# Altium schematic sheet 11 AM572x Interface 2.SchDoc
size 420 x 297 mm
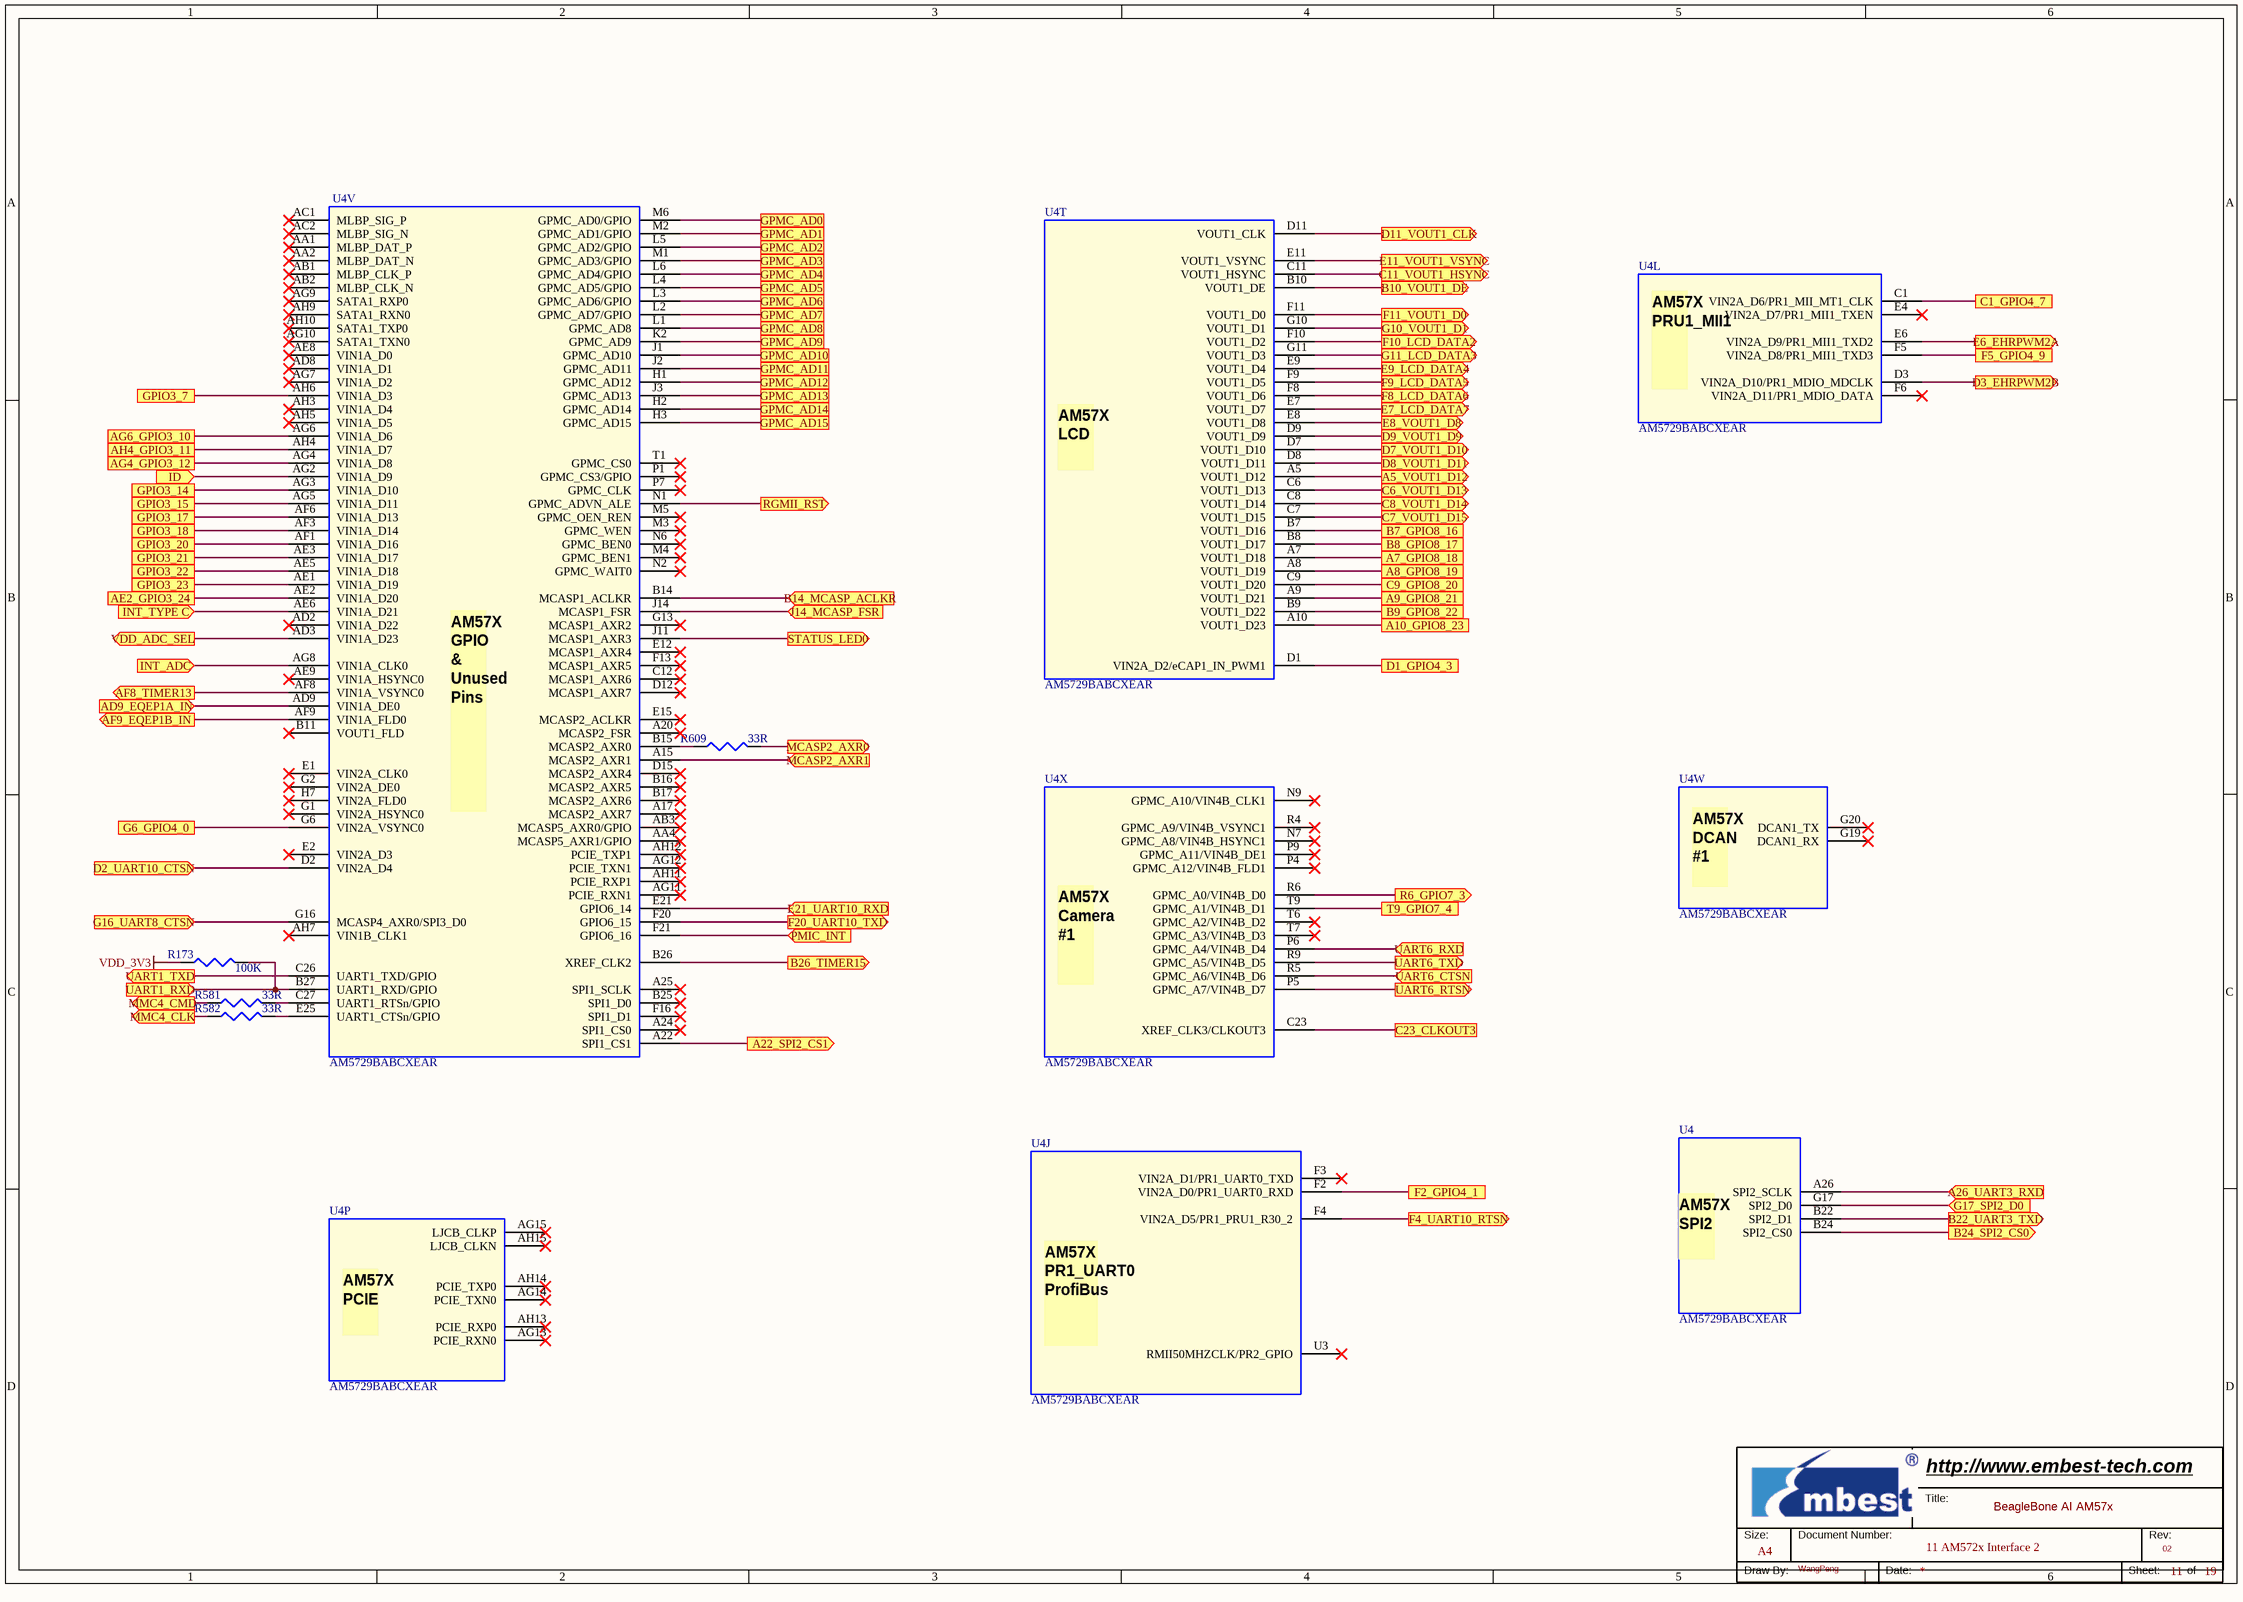
[diagram p0: 11 AM572x Interface 2.SchDoc]

## Parts
*  Page Count: 19  Page Number: 11  Page Size: A4  Title: BeagleBone AI AM57x  RevCode: 02  Doc: 11 AM572x Interface 2  Drawing: WangPeng  (hidden comment: Embest Title)  (graphical)
R173  100K  [R0402]
R581  33R  [R0402]
R582  33R  [R0402]
R609  33R  [R0402]
U4  AM5729BABCXEAR  [BGA23X23-760-117M]  (parts J,L,P,T,V,W,X,28 of 29)

## Ports
A5_VOUT1_D12 (out), A7_GPIO8_18, A8_GPIO8_19, A9_GPIO8_21, A10_GPIO8_23, A22_SPI2_CS1 (out), A26_UART3_RXD (in), AD9_EQEP1A_IN (in), AE2_GPIO3_24, AF8_TIMER13 (out), AF9_EQEP1B_IN (out), AG4_GPIO3_12, AG6_GPIO3_10, AH4_GPIO3_11, B7_GPIO8_16, B8_GPIO8_17, B9_GPIO8_22, B10_VOUT1_DE (out), B14_MCASP_ACLKR (in), B22_UART3_TXD (out), B24_SPI2_CS0 (out), B26_TIMER15 (out), C1_GPIO4_7, C6_VOUT1_D13 (out), C7_VOUT1_D15 (out), C8_VOUT1_D14 (out), C9_GPIO8_20, C11_VOUT1_HSYNC (out), C23_CLKOUT3, D1_GPIO4_3, D2_UART10_CTSN (in), D3_EHRPWM2B (out), D7_VOUT1_D10 (out), D8_VOUT1_D11 (out), D9_VOUT1_D9 (out), D11_VOUT1_CLK (out), E6_EHRPWM2A (out), E7_LCD_DATA7 (out), E8_VOUT1_D8 (out), E9_LCD_DATA4 (out), E11_VOUT1_VSYNC (out), E21_UART10_RXD (in), F2_GPIO4_1, F4_UART10_RTSN (out), F5_GPIO4_9, F8_LCD_DATA6 (out), F9_LCD_DATA5 (out), F10_LCD_DATA2 (out), F11_VOUT1_D0 (out), F20_UART10_TXD (out), G6_GPIO4_0, G10_VOUT1_D1 (out), G11_LCD_DATA3 (out), G16_UART8_CTSN (in), G17_SPI2_D0 (in), GPIO3_7, GPIO3_14, GPIO3_15, GPIO3_17, GPIO3_18, GPIO3_20, GPIO3_21, GPIO3_22, GPIO3_23, GPMC_AD0, GPMC_AD1, GPMC_AD2, GPMC_AD3, GPMC_AD4, GPMC_AD5, GPMC_AD6, GPMC_AD7, GPMC_AD8, GPMC_AD9, GPMC_AD10, GPMC_AD11, GPMC_AD12, GPMC_AD13, GPMC_AD14, GPMC_AD15, ID (in), INT_ADC (in), INT_TYPE C (in), J14_MCASP_FSR (in), MCASP2_AXR0 (out), MCASP2_AXR1 (in), MMC4_CLK (out), MMC4_CMD (out), PMIC_INT (in), R6_GPIO7_3 (out), RGMII_RST (out), STATUS_LED0 (out), T9_GPIO7_4, UART1_RXD (in), UART1_TXD (out), UART6_CTSN (in), UART6_RTSN (out), UART6_RXD (in), UART6_TXD (out), VDD_ADC_SEL (out)

## Nets
VDD_3V3: R173.1
A5_VOUT1_D12: U4.A5(VOUT1_D12) ; port A5_VOUT1_D12
A7_GPIO8_18: U4.A7(VOUT1_D18) ; port A7_GPIO8_18
A8_GPIO8_19: U4.A8(VOUT1_D19) ; port A8_GPIO8_19
A9_GPIO8_21: U4.A9(VOUT1_D21) ; port A9_GPIO8_21
A10_GPIO8_23: U4.A10(VOUT1_D23) ; port A10_GPIO8_23
A22_SPI2_CS1: U4.A22(SPI1_CS1) ; port A22_SPI2_CS1
A26_UART3_RXD: U4.A26(SPI2_SCLK) ; port A26_UART3_RXD
AD9_EQEP1A_IN: U4.AD9(VIN1A_DE0) ; port AD9_EQEP1A_IN
AE2_GPIO3_24: U4.AE2(VIN1A_D20) ; port AE2_GPIO3_24
AF8_TIMER13: U4.AF8(VIN1A_VSYNC0) ; port AF8_TIMER13
AF9_EQEP1B_IN: U4.AF9(VIN1A_FLD0) ; port AF9_EQEP1B_IN
AG4_GPIO3_12: U4.AG4(VIN1A_D8) ; port AG4_GPIO3_12
AG6_GPIO3_10: U4.AG6(VIN1A_D6) ; port AG6_GPIO3_10
AH4_GPIO3_11: U4.AH4(VIN1A_D7) ; port AH4_GPIO3_11
B7_GPIO8_16: U4.B7(VOUT1_D16) ; port B7_GPIO8_16
B8_GPIO8_17: U4.B8(VOUT1_D17) ; port B8_GPIO8_17
B9_GPIO8_22: U4.B9(VOUT1_D22) ; port B9_GPIO8_22
B10_VOUT1_DE: U4.B10(VOUT1_DE) ; port B10_VOUT1_DE
B14_MCASP_ACLKR: U4.B14(MCASP1_ACLKR) ; port B14_MCASP_ACLKR
B22_UART3_TXD: U4.B22(SPI2_D1) ; port B22_UART3_TXD
B24_SPI2_CS0: U4.B24(SPI2_CS0) ; port B24_SPI2_CS0
B26_TIMER15: U4.B26(XREF_CLK2) ; port B26_TIMER15
C1_GPIO4_7: U4.C1(VIN2A_D6/PR1_MII_MT1_CLK) ; port C1_GPIO4_7
C6_VOUT1_D13: U4.C6(VOUT1_D13) ; port C6_VOUT1_D13
C7_VOUT1_D15: U4.C7(VOUT1_D15) ; port C7_VOUT1_D15
C8_VOUT1_D14: U4.C8(VOUT1_D14) ; port C8_VOUT1_D14
C9_GPIO8_20: U4.C9(VOUT1_D20) ; port C9_GPIO8_20
C11_VOUT1_HSYNC: U4.C11(VOUT1_HSYNC) ; port C11_VOUT1_HSYNC
C23_CLKOUT3: U4.C23(XREF_CLK3/CLKOUT3) ; port C23_CLKOUT3
D1_GPIO4_3: U4.D1(VIN2A_D2/eCAP1_IN_PWM1) ; port D1_GPIO4_3
D2_UART10_CTSN: U4.D2(VIN2A_D4) ; port D2_UART10_CTSN
D3_EHRPWM2B: U4.D3(VIN2A_D10/PR1_MDIO_MDCLK) ; port D3_EHRPWM2B
D7_VOUT1_D10: U4.D7(VOUT1_D10) ; port D7_VOUT1_D10
D8_VOUT1_D11: U4.D8(VOUT1_D11) ; port D8_VOUT1_D11
D9_VOUT1_D9: U4.D9(VOUT1_D9) ; port D9_VOUT1_D9
D11_VOUT1_CLK: U4.D11(VOUT1_CLK) ; port D11_VOUT1_CLK
E6_EHRPWM2A: U4.E6(VIN2A_D9/PR1_MII1_TXD2) ; port E6_EHRPWM2A
E7_LCD_DATA7: U4.E7(VOUT1_D7) ; port E7_LCD_DATA7
E8_VOUT1_D8: U4.E8(VOUT1_D8) ; port E8_VOUT1_D8
E9_LCD_DATA4: U4.E9(VOUT1_D4) ; port E9_LCD_DATA4
E11_VOUT1_VSYNC: U4.E11(VOUT1_VSYNC) ; port E11_VOUT1_VSYNC
E21_UART10_RXD: U4.E21(GPIO6_14) ; port E21_UART10_RXD
F2_GPIO4_1: U4.F2(VIN2A_D0/PR1_UART0_RXD) ; port F2_GPIO4_1
F4_UART10_RTSN: U4.F4(VIN2A_D5/PR1_PRU1_R30_2) ; port F4_UART10_RTSN
F5_GPIO4_9: U4.F5(VIN2A_D8/PR1_MII1_TXD3) ; port F5_GPIO4_9
F8_LCD_DATA6: U4.F8(VOUT1_D6) ; port F8_LCD_DATA6
F9_LCD_DATA5: U4.F9(VOUT1_D5) ; port F9_LCD_DATA5
F10_LCD_DATA2: U4.F10(VOUT1_D2) ; port F10_LCD_DATA2
F11_VOUT1_D0: U4.F11(VOUT1_D0) ; port F11_VOUT1_D0
F20_UART10_TXD: U4.F20(GPIO6_15) ; port F20_UART10_TXD
G6_GPIO4_0: U4.G6(VIN2A_VSYNC0) ; port G6_GPIO4_0
G10_VOUT1_D1: U4.G10(VOUT1_D1) ; port G10_VOUT1_D1
G11_LCD_DATA3: U4.G11(VOUT1_D3) ; port G11_LCD_DATA3
G16_UART8_CTSN: U4.G16(MCASP4_AXR0/SPI3_D0) ; port G16_UART8_CTSN
G17_SPI2_D0: U4.G17(SPI2_D0) ; port G17_SPI2_D0
GPIO3_7: U4.AH6(VIN1A_D3) ; port GPIO3_7
GPIO3_14: U4.AG3(VIN1A_D10) ; port GPIO3_14
GPIO3_15: U4.AG5(VIN1A_D11) ; port GPIO3_15
GPIO3_17: U4.AF6(VIN1A_D13) ; port GPIO3_17
GPIO3_18: U4.AF3(VIN1A_D14) ; port GPIO3_18
GPIO3_20: U4.AF1(VIN1A_D16) ; port GPIO3_20
GPIO3_21: U4.AE3(VIN1A_D17) ; port GPIO3_21
GPIO3_22: U4.AE5(VIN1A_D18) ; port GPIO3_22
GPIO3_23: U4.AE1(VIN1A_D19) ; port GPIO3_23
GPMC_AD0: U4.M6(GPMC_AD0/GPIO) ; port GPMC_AD0
GPMC_AD1: U4.M2(GPMC_AD1/GPIO) ; port GPMC_AD1
GPMC_AD2: U4.L5(GPMC_AD2/GPIO) ; port GPMC_AD2
GPMC_AD3: U4.M1(GPMC_AD3/GPIO) ; port GPMC_AD3
GPMC_AD4: U4.L6(GPMC_AD4/GPIO) ; port GPMC_AD4
GPMC_AD5: U4.L4(GPMC_AD5/GPIO) ; port GPMC_AD5
GPMC_AD6: U4.L3(GPMC_AD6/GPIO) ; port GPMC_AD6
GPMC_AD7: U4.L2(GPMC_AD7/GPIO) ; port GPMC_AD7
GPMC_AD8: U4.L1(GPMC_AD8) ; port GPMC_AD8
GPMC_AD9: U4.K2(GPMC_AD9) ; port GPMC_AD9
GPMC_AD10: U4.J1(GPMC_AD10) ; port GPMC_AD10
GPMC_AD11: U4.J2(GPMC_AD11) ; port GPMC_AD11
GPMC_AD12: U4.H1(GPMC_AD12) ; port GPMC_AD12
GPMC_AD13: U4.J3(GPMC_AD13) ; port GPMC_AD13
GPMC_AD14: U4.H2(GPMC_AD14) ; port GPMC_AD14
GPMC_AD15: U4.H3(GPMC_AD15) ; port GPMC_AD15
ID: U4.AG2(VIN1A_D9) ; port ID
INT_ADC: U4.AG8(VIN1A_CLK0) ; port INT_ADC
INT_TYPE C: U4.AE6(VIN1A_D21) ; port INT_TYPE C
J14_MCASP_FSR: U4.J14(MCASP1_FSR) ; port J14_MCASP_FSR
MCASP2_AXR0: R609.2 ; port MCASP2_AXR0
MCASP2_AXR1: U4.A15(MCASP2_AXR1) ; port MCASP2_AXR1
MMC4_CLK: R582.1 ; port MMC4_CLK
MMC4_CMD: R581.1 ; port MMC4_CMD
PMIC_INT: U4.F21(GPIO6_16) ; port PMIC_INT
R6_GPIO7_3: U4.R6(GPMC_A0/VIN4B_D0) ; port R6_GPIO7_3
RGMII_RST: U4.N1(GPMC_ADVN_ALE) ; port RGMII_RST
STATUS_LED0: U4.J11(MCASP1_AXR3) ; port STATUS_LED0
T9_GPIO7_4: U4.T9(GPMC_A1/VIN4B_D1) ; port T9_GPIO7_4
UART1_RXD: R173.2 U4.B27(UART1_RXD/GPIO) ; port UART1_RXD
UART1_TXD: U4.C26(UART1_TXD/GPIO) ; port UART1_TXD
UART6_CTSN: U4.R5(GPMC_A6/VIN4B_D6) ; port UART6_CTSN
UART6_RTSN: U4.P5(GPMC_A7/VIN4B_D7) ; port UART6_RTSN
UART6_RXD: U4.P6(GPMC_A4/VIN4B_D4) ; port UART6_RXD
UART6_TXD: U4.R9(GPMC_A5/VIN4B_D5) ; port UART6_TXD
VDD_ADC_SEL: U4.AD3(VIN1A_D23) ; port VDD_ADC_SEL
NetR581_2: R581.2 U4.C27(UART1_RTSn/GPIO)
NetR582_2: R582.2 U4.E25(UART1_CTSn/GPIO)
NetR609_1: R609.1 U4.B15(MCASP2_AXR0)

Not connected (* = marked no-connect by the designer): U4 A17(MCASP2_AXR7)* A20(MCASP2_FSR)* A24(SPI1_CS0)* A25(SPI1_SCLK)* AA1(MLBP_DAT_P)* AA2(MLBP_DAT_N)* AA4(MCASP5_AXR1/GPIO)* AB1(MLBP_CLK_P)* AB2(MLBP_CLK_N)* AB3(MCASP5_AXR0/GPIO)* AC1(MLBP_SIG_P)* AC2(MLBP_SIG_N)* AD2(VIN1A_D22)* AD8(VIN1A_D1)* AE8(VIN1A_D0)* AE9(VIN1A_HSYNC0)* AG7(VIN1A_D2)* AG9(SATA1_RXP0)* AG10(SATA1_TXN0)* AG11(PCIE_RXN1)* AG12(PCIE_TXN1)* AG13(PCIE_RXN0)* AG14(PCIE_TXN0)* AG15(LJCB_CLKP)* AH3(VIN1A_D4)* AH5(VIN1A_D5)* AH7(VIN1B_CLK1)* AH9(SATA1_RXN0)* AH10(SATA1_TXP0)* AH11(PCIE_RXP1)* AH12(PCIE_TXP1)* AH13(PCIE_RXP0)* AH14(PCIE_TXP0)* AH15(LJCB_CLKN)* B11(VOUT1_FLD)* B16(MCASP2_AXR5)* B17(MCASP2_AXR6)* B25(SPI1_D0)* C12(MCASP1_AXR6)* D12(MCASP1_AXR7)* D15(MCASP2_AXR4)* E1(VIN2A_CLK0)* E2(VIN2A_D3)* E4(VIN2A_D7/PR1_MII1_TXEN)* E12(MCASP1_AXR4)* E15(MCASP2_ACLKR)* F3(VIN2A_D1/PR1_UART0_TXD)* F6(VIN2A_D11/PR1_MDIO_DATA)* F13(MCASP1_AXR5)* F16(SPI1_D1)* G1(VIN2A_HSYNC0)* G2(VIN2A_DE0)* G13(MCASP1_AXR2)* G19(DCAN1_RX)* G20(DCAN1_TX)* H7(VIN2A_FLD0)* M3(GPMC_WEN)* M4(GPMC_BEN1)* M5(GPMC_OEN_REN)* N2(GPMC_WAIT0)* N6(GPMC_BEN0)* N7(GPMC_A8/VIN4B_HSYNC1)* N9(GPMC_A10/VIN4B_CLK1)* P1(GPMC_CS3/GPIO)* P4(GPMC_A12/VIN4B_FLD1)* P7(GPMC_CLK)* P9(GPMC_A11/VIN4B_DE1)* R4(GPMC_A9/VIN4B_VSYNC1)* T1(GPMC_CS0)* T6(GPMC_A2/VIN4B_D2)* T7(GPMC_A3/VIN4B_D3)* U3(RMII50MHZCLK/PR2_GPIO)*

## Notes on the sheet
- (in symbol AM57X, part J) AM57X / PR1_UART0 / ProfiBus /
- (in symbol AM57X, part L) AM57X / PRU1_MII1 /
- (in symbol AM57X, part P) AM57X / PCIE /
- (in symbol AM57X, part T) AM57X / LCD /
- (in symbol AM57X, part V) AM57X GPIO & Unused / Pins /
- (in symbol AM57X, part W) AM57X / DCAN #1 /
- (in symbol AM57X, part X) AM57X / Camera #1 /
- (in symbol AM57X, part 28) AM57X / SPI2 /
- (in symbol Embest Title) Title:; Size:; Document Number:; Rev:; Draw By:; Date:; Sheet:; of

## Library data of the parts
R173 = R: RES,100K,+/-5%,1/16W,SMD0402; Manufacturer Part Number: RC0402JR-07100KL; Manufacturer: YAGEO; Embest PN: 1003001100119; Part Type: Thick film Resistor
R581 R582 = R: RES,33R,+/-5%,1/16W,SMD0402; Manufacturer Part Number: RC0402JR-0733RL; Manufacturer: YAGEO; Embest PN: 1003001100010; Part Type: Thick film Resistor
R609 = R: RES,33R,+/-5%,1/16W,SMD0402; Manufacturer: YAGEO; Manufacturer Part Number: RC0402JR-0733RL; Embest PN: 1003001100010; Part Type: Thick film Resistor
U4 = AM57X: IC ARM Dual Cortex-A15 Microprocessor FCBGA(ABC)-760 SMD JEDEC TRAY; Vendor: TI; Embest PN: 1002001100053; Part Type: MPU; Manufacturer: TI; Manufacturer Part Number: AM5729BABCXEAR; Status: BeagleBone AI
* = Embest Title: Page Create Date: May 29, 2006; WebSite: http://www.embest-tech.com; Company: Embest; Page Modify Date: *